# EasyEDA Pro project Trace_4层_2.8TFT码表_AT32F435RGT7_阻抗匹配.eprj

# Schematic Trace

## Sheets
1 Sheet_1 copy
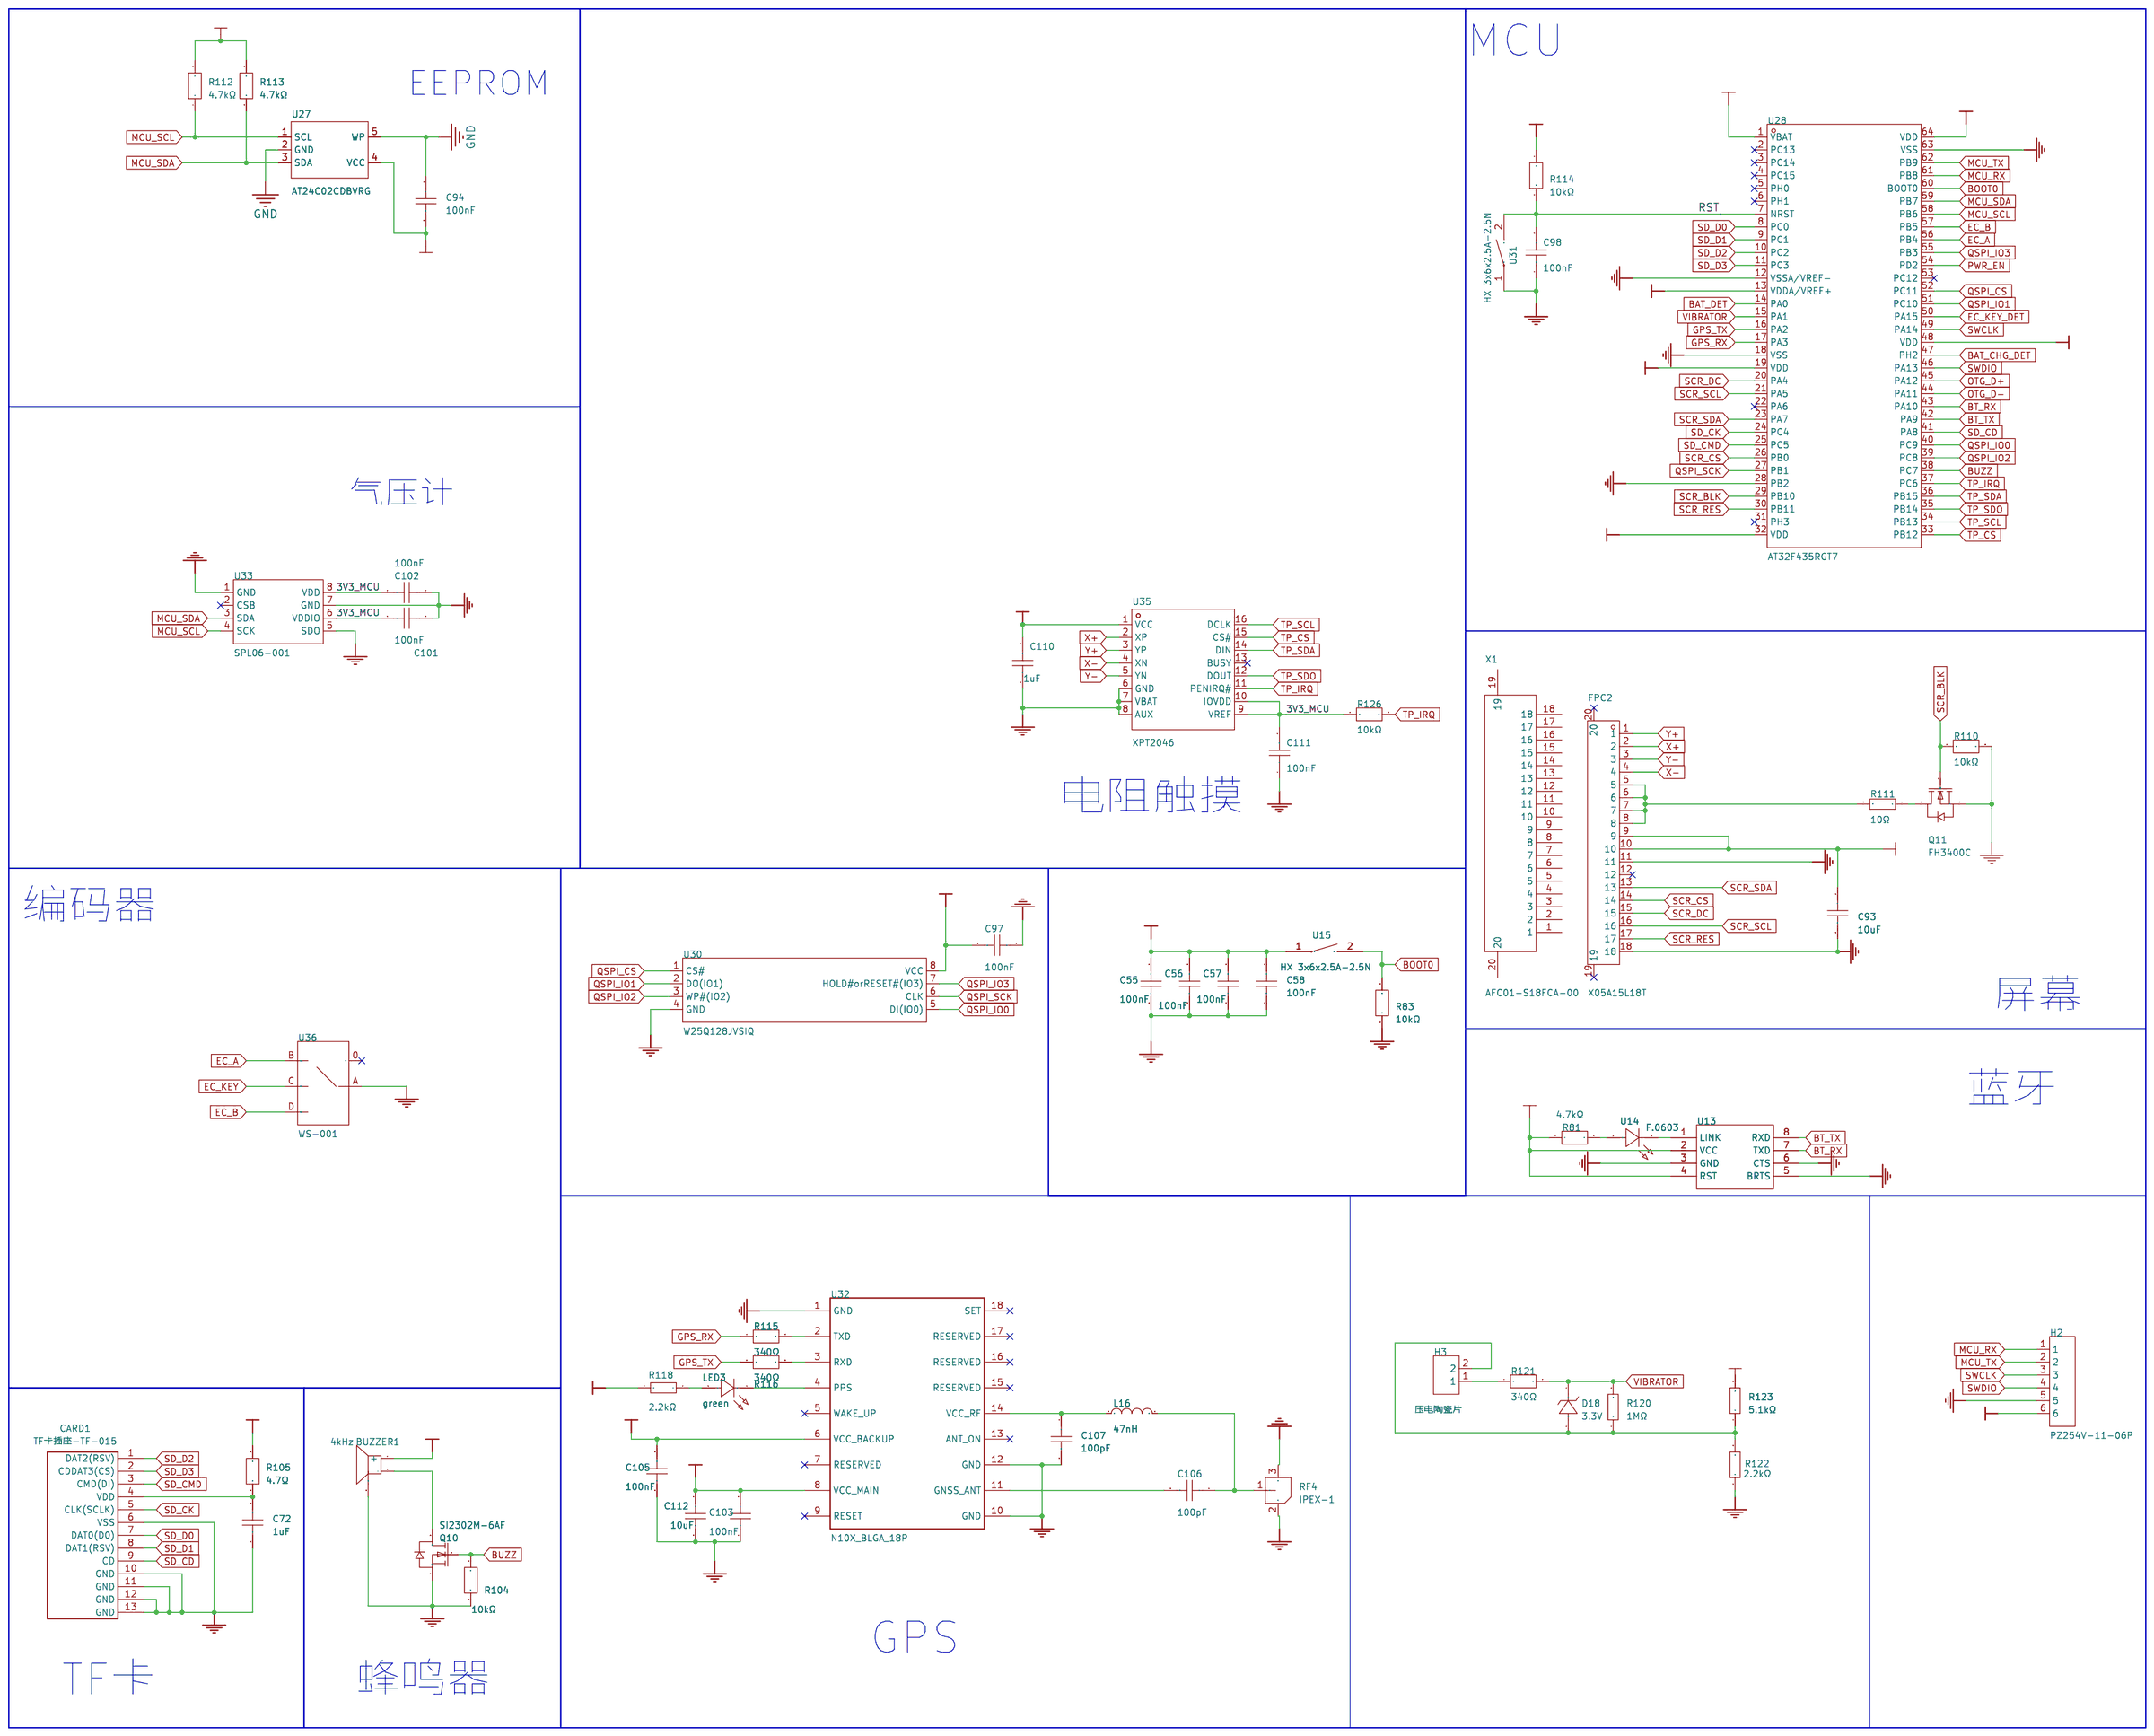
[diagram p0: Sheet_1 copy]
2 Power_Supply: Board Name: Trace; Create Date: 2025-09-24; Page Name: Power_Supply; Project Name: Trace_4层_2.8TFT码表_AT32F435RGT7_阻抗匹配; Schematic Name: Trace; Update Date: 2025-09-24; Company: 嘉立创EDA; Page Size: A4; Version: V1.0
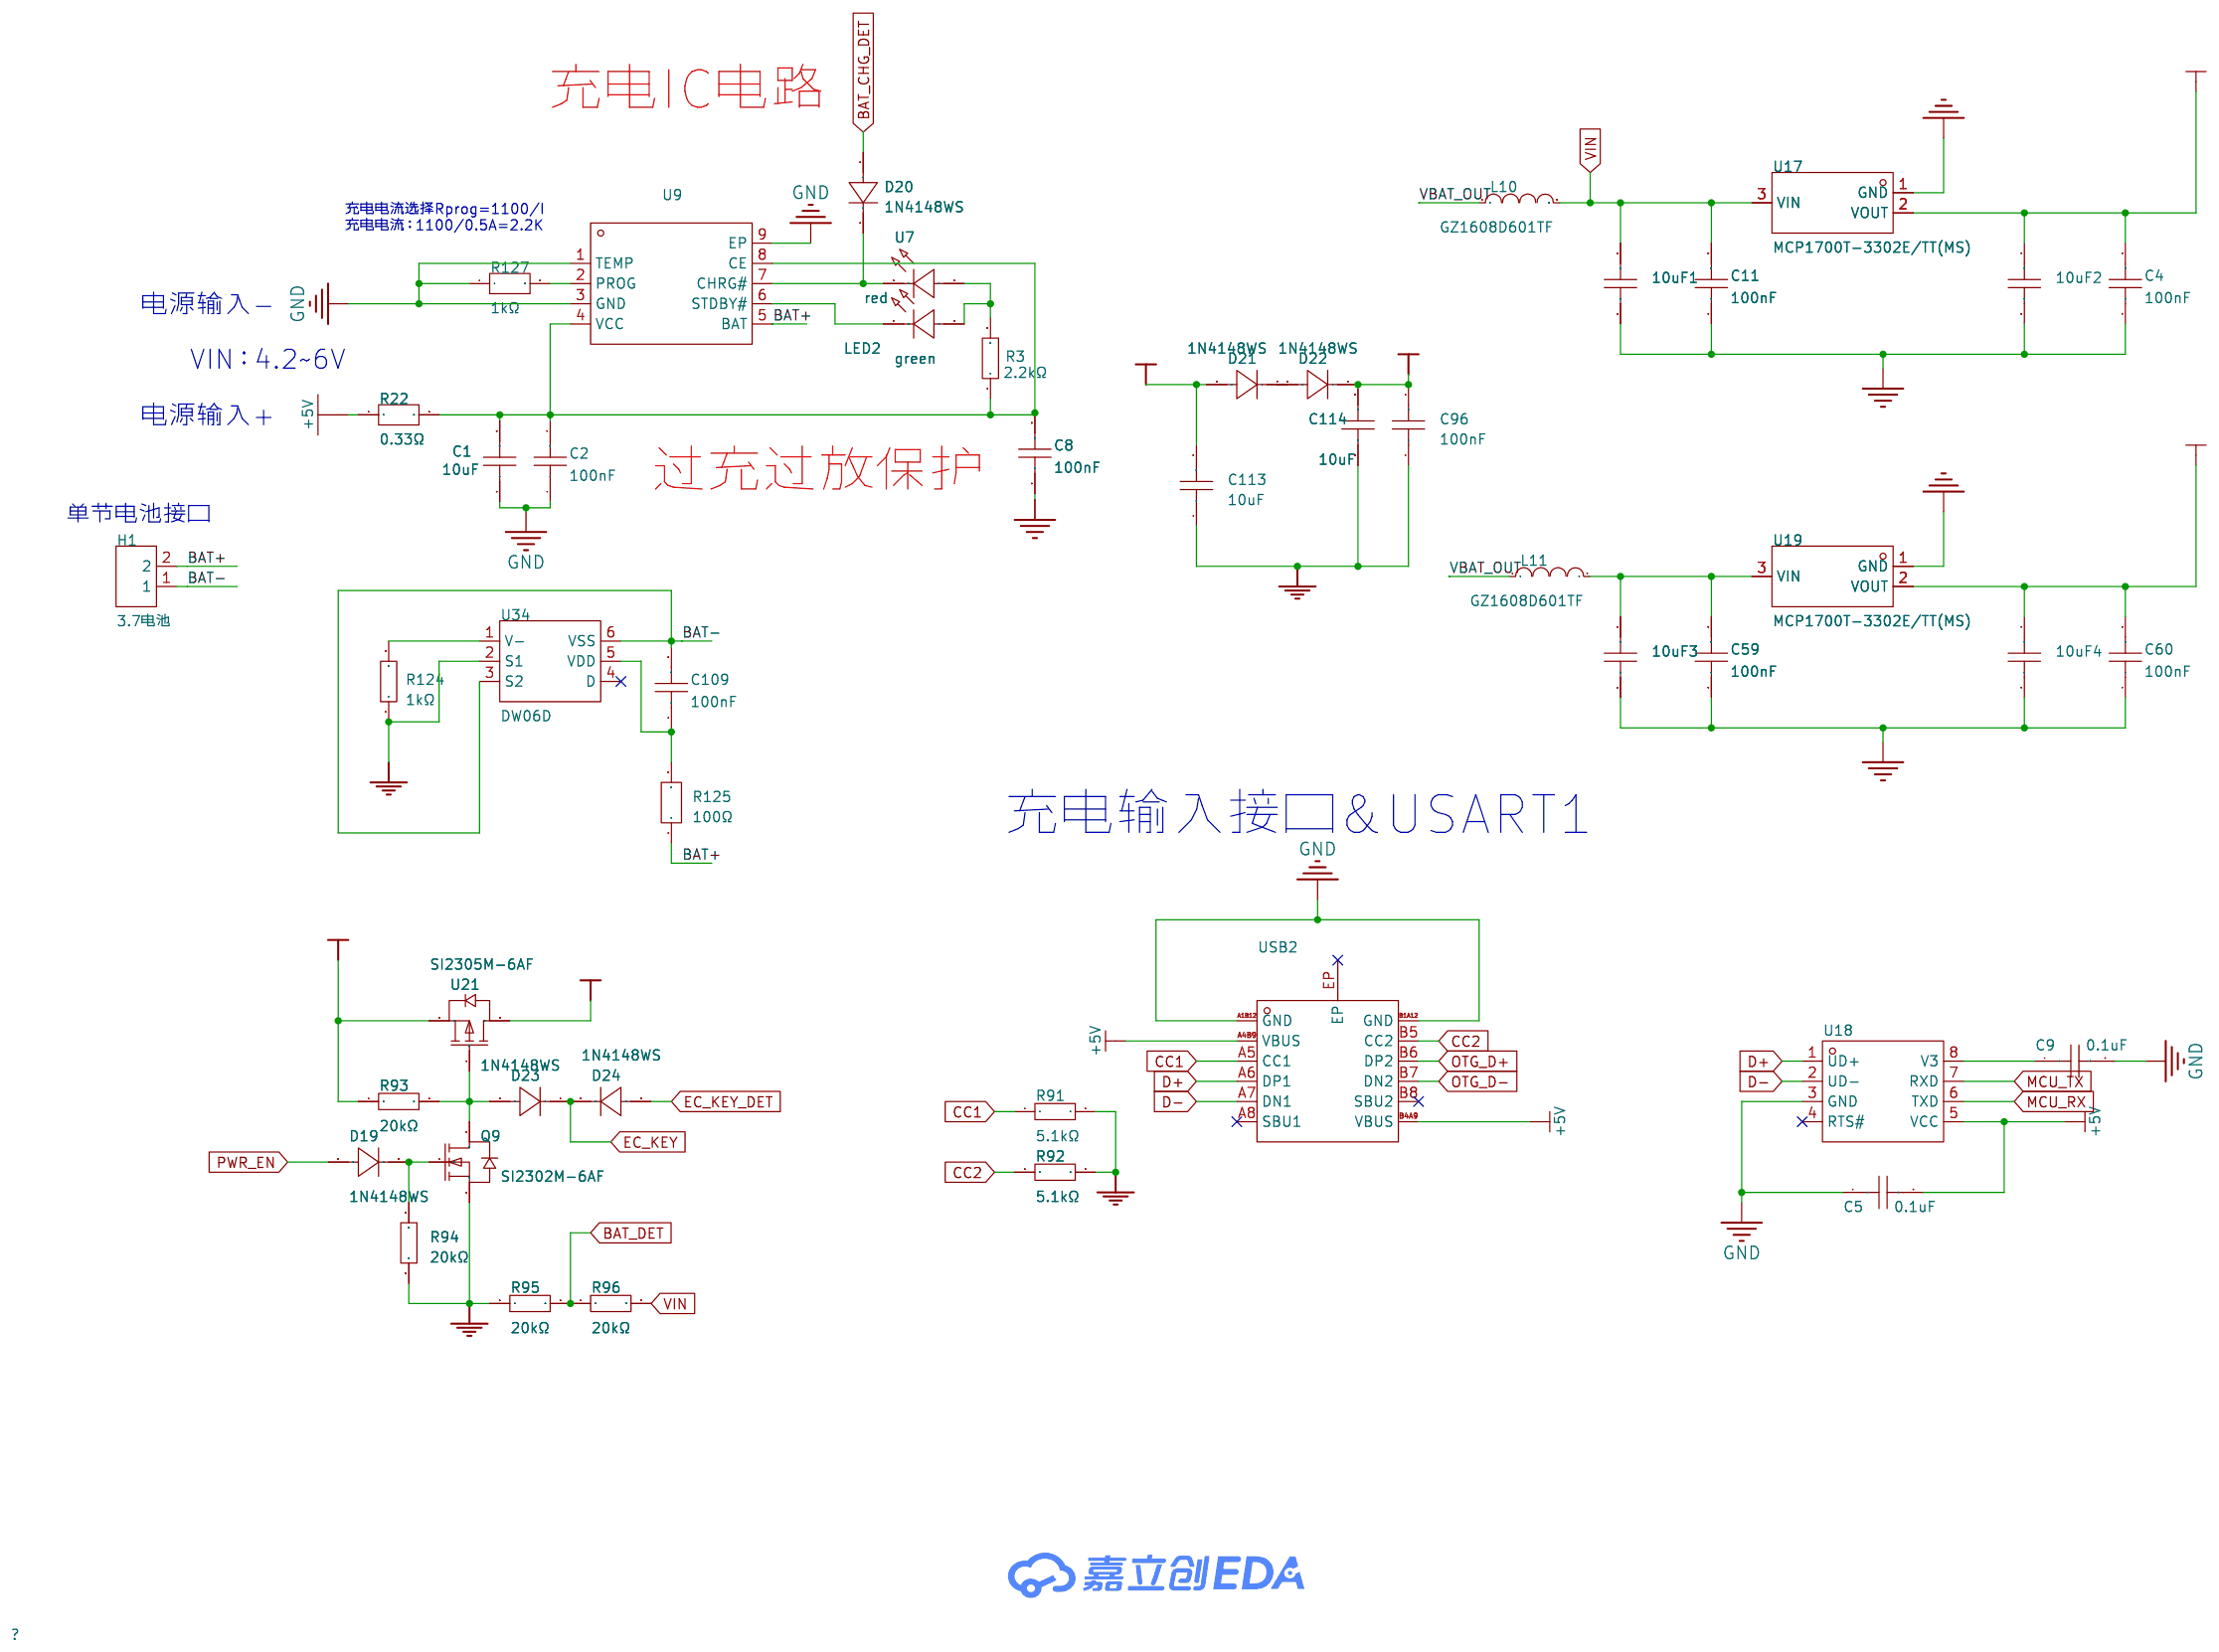
[diagram p1: Power_Supply]

## Parts
sheet Power_Supply
10uF1  10uF  [C0603]
10uF2  10uF  [C0603]
10uF3  10uF  [C0603]
10uF4  10uF  [C0603]
C1  10uF  [C0603]
C2  100nF  [C0603]
C4  100nF  [C0603]
C5  0.1uF  [C0603]
C8  100nF  [C0603]
C9  0.1uF  [C0603]
C11  100nF  [C0603]
C59  100nF  [C0603]
C60  100nF  [C0603]
C96  100nF  [C0603]
C109  100nF  [C0603]
C113  10uF  [C0603]
C114  10uF  [C0603]
D19  1N4148WS  [SOD-323_L1.8-W1.3-LS2.5-RD]
D20  1N4148WS  [SOD-323_L1.8-W1.3-LS2.5-RD]
D21  1N4148WS  [SOD-323_L1.8-W1.3-LS2.5-RD]
D22  1N4148WS  [SOD-323_L1.8-W1.3-LS2.5-RD]
D23  1N4148WS  [SOD-323_L1.8-W1.3-LS2.5-RD]
D24  1N4148WS  [SOD-323_L1.8-W1.3-LS2.5-RD]
H1  3.7电池  [HDR-TH_2P-P2.54-V-M]
L10  GZ1608D601TF  [L0603]
L11  GZ1608D601TF  [L0603]
LED2  green  [LED0603-RD_GREEN]
Q9  SI2302M-6AF  [SOT-23-3_L2.9-W1.3-P1.90-LS2.4-BR]
R3  2.2kΩ  [R0603]
R22  0.33Ω  [R1206]
R91  5.1kΩ  [R0603]
R92  5.1kΩ  [R0603]
R93  20kΩ  [R0603]
R94  20kΩ  [R0603]
R95  20kΩ  [R0603]
R96  20kΩ  [R0603]
R124  1kΩ  [R0603]
R125  100Ω  [R0603]
R127  1kΩ  [R0603]
U7  red  [LED0603-RD]
U9  -  [ESOP-8_L4.9-W3.9-P1.27-LS6.0-BL-EP]
U17  MCP1700T-3302E/TT(MS)  [SOT-23-3_L2.9-W1.3-P1.90-LS2.4-BR]
U18  -  [SOP-8_L4.9-W3.9-P1.27-LS6.0-BL]
U19  MCP1700T-3302E/TT(MS)  [SOT-23-3_L2.9-W1.3-P1.90-LS2.4-BR]
U21  SI2305M-6AF  [SOT-23-3_L2.9-W1.3-P1.90-LS2.4-BR]
U34  DW06D  [SOT-23-6_L2.9-W1.6-P0.95-LS2.8-BR]
USB2  -  [USB-C-SMD_TYPE-C-16P-1]
sheet Sheet_1 copy
BUZZER1  4kHz  [BUZ-SMD_3P-SMD5020-ZK]
C55  100nF  [C0603]
C56  100nF  [C0603]
C57  100nF  [C0603]
C58  100nF  [C0603]
C72  1uF  [C0603]
C93  10uF  [C0603]
C94  100nF  [C0603]
C97  100nF  [C0603]
C98  100nF  [C0603]
C101  100nF  [C0603]
C102  100nF  [C0603]
C103  100nF  [C0603]
C105  100nF  [C0603]
C106  100pF  [C0603]
C107  100pF  [C0603]
C110  1uF  [C0603]
C111  100nF  [C0603]
C112  10uF  [C0603]
CARD1  TF卡插座-TF-015  [TF卡插座-TF-015]
D18  3.3V  [SOD-323_L1.7-W1.3-LS2.6-RD]
FPC2  X05A15L18T  [FFC-SMD_18P-P0.50_X05A15L18T]
H2  PZ254V-11-06P  [HDR-TH_6P-P2.54-V-M]
H3  压电陶瓷片  [HDR-TH_2P-P2.54-V-M]
L16  47nH  [IND-SMD_L1.8-W1.0]
LED3  green  [LED0603-RD_GREEN]
Q10  SI2302M-6AF  [SOT-23-3_L2.9-W1.3-P1.90-LS2.4-BR]
Q11  FH3400C  [SOT-23-3_L2.9-W1.3-P1.90-LS2.4-BR]
R81  4.7kΩ  [R0603]
R83  10kΩ  [R0603]
R104  10kΩ  [R0603]
R105  4.7Ω  [R0603]
R110  10kΩ  [R0603]
R111  10Ω  [R0603]
R112  4.7kΩ  [R0603]
R113  4.7kΩ  [R0603]
R114  10kΩ  [R0603]
R115  340Ω  [R0603]
R116  340Ω  [R0603]
R118  2.2kΩ  [R0603]
R120  1MΩ  [R0603]
R121  340Ω  [R0603]
R122  2.2kΩ  [R0603]
R123  5.1kΩ  [R0603]
R126  10kΩ  [R0603]
RF4  IPEX-1  [IPEX-SMD_3P-L2.6-W2.6-LS3.0_RF1200001R]
U13  -  [XY-MBO35A]
U14  F.0603  [LED0603-RD]
U15  HX 3x6x2.5A-2.5N  [SW-SMD_HX-TS-1101-C-W]
U27  AT24C02CDBVRG  [SOT-23-5_L2.9-W1.6-P0.95-LS2.8-BR]
U28  AT32F435RGT7  [LQFP-64_L10.0-W10.0-P0.50-LS12.0-BL]
U30  W25Q128JVSIQ  [SOIC-8_L5.3-W5.3-P1.27-LS8.0-BL]
U31  HX 3x6x2.5A-2.5N  [SW-SMD_HX-TS-1101-C-W]
U32  N10X_BLGA_18P  [N10_BLGA_18P]
U33  SPL06-001  [SENSOR-SMD_SPL06-001]
U35  XPT2046  [TSSOP-16_L5.0-W4.4-P0.65-LS6.4-BL]
U36  WS-001  [SW-SMD_WS-001]
X1  AFC01-S18FCA-00  [FPC-SMD_18P-P0.50_JS_AFC01-S18FCA-00]

## Library data of the parts
10uF1-10uF4 = CAP_0603: Supplier Footprint: 0603
C1 = CL10A106KP8NNNC: 容值:10uF;精度:±10%;额定电压:10V;材质(温度系数):X5R;; LCSC Part Name: 10uF ±10% 10V; Supplier Part: C19702; Manufacturer: SAMSUNG(三星); Supplier Footprint: 0603; JLCPCB Part Class: 基础库; Datasheet: https://atta.szlcsc.com/upload/public/pdf/source/20160218/1457707763339.pdf; Supplier: LCSC; Tolerance: ±10%; Voltage Rated: 10V; Temperature Coefficient: X5R
C2 C4 C8 C11 C55-C60 C94 C96-C98 C101-C103 C105 C109 C111 = CC0603KRX7R9BB104: 容值:100nF;精度:±10%;额定电压:50V;温度系数:X7R;; LCSC Part Name: 100nF ±10% 50V; Supplier Part: C14663; Manufacturer: YAGEO(国巨); Supplier Footprint: 0603; JLCPCB Part Class: 基础库; Datasheet: https://atta.szlcsc.com/upload/public/pdf/source/20250214/096C4C206003071F5D32E5F0D8E7F8DF.pdf; Supplier: LCSC; Tolerance: ±10%; Voltage Rating: 50V; Temperature Coefficient: X7R
C5 C9 = CAP_0603: 容值:100nF;精度:±10%;额定电压:50V;温度系数:X7R;; Supplier Footprint: 0603
C112-C114 = CL10A106MA8NRNC: LCSC Part Name: 10uF ±20% 25V; Supplier Part: C96446; Manufacturer: SAMSUNG(三星); Supplier Footprint: 0603; JLCPCB Part Class: 基础库; Datasheet: https://item.szlcsc.com/datasheet/CL10A106MA8NRNC/97651.html; Supplier: LCSC; Tolerance: ±20%; Voltage Rating: 25V; Temperature Coefficient: X5R
D19-D24 = 1N4148WS: LCSC Part Name: 电压:100V 电流:150mA; Supplier Part: C909968; Manufacturer: GOODWORK(固得沃克); Supplier Footprint: SOD-323; JLCPCB Part Class: 扩展库; Datasheet: https://item.szlcsc.com/datasheet/1N4148WS/977348.html; Supplier: LCSC; Diode Configuration: 独立式; Voltage - Forward(Vf@If): 1.25V@150mA; Voltage - DC Reverse(Vr): 100V; Current - Rectified: 150mA; Pd - Power Dissipation: 250mW; Reverse Leakage Current (Ir): 1uA@100V; Reverse Recovery Time (trr): 4ns; Operating Junction Temperature Range: -55℃~+150℃@(Tj)
H1 H3 = PZ254V-11-02P: 插针结构:1x2P;间距:2.54mm;行距:-;圆针/方针:方针;安装方式:直插;排数:单排;总PIN位数:2P;额定电流:-;额定电压:-;配合针长度:6mm;塑高:2.5mm;端接针长度:3mm;触头材质:黄铜;触头镀层:-;工作温度:-40℃~+105℃;颜色:黑色;; LCSC Part Name: 1x2P 间距:2.54mm 方针 直插; Supplier Part: C492401; Manufacturer: XFCN(兴飞); Supplier Footprint: 插件,P=2.54mm; JLCPCB Part Class: 扩展库; Datasheet: https://atta.szlcsc.com/upload/public/pdf/source/20200309/C492401_A812433581A9B211A7FFA413ADDFF0E5.pdf; Supplier: LCSC; Pin Structure: 1x2P; Pitch: 2.54mm; Circluar Pins/Square Pins: 方针; Mounting Type: 直插; Number of Rows: 单排; Number of Pins: 2P; Length of Mating Pin: 6mm; Insulation Height: 2.5mm; Length of End Connection Pin: 3mm; Contact Material: 黄铜; Operating Temperature: -40℃~+105℃; Color: 黑色
L10 L11 = GZ1608D601TF: 阻抗 @ 频率:600Ω@100MHz;误差:±25%;直流电阻(DCR):450mΩ;; LCSC Part Name: 单路 0603磁珠 阻抗600Ω@100MHz; Supplier Part: C1002; Manufacturer: Sunlord(顺络); Supplier Footprint: 0603; JLCPCB Part Class: 基础库; Datasheet: https://atta.szlcsc.com/upload/public/pdf/source/20241120/893429B990C3BA07384E734821D2F218.pdf; Supplier: LCSC; Impedance @ Frequency: 600Ω@100MHz; Tolerance: ±25%; DC Resistance: 450mΩ; Current Rating: 200mA; Circuits: 1
LED2 LED3 = F.0603.00025/P2-0603G1TS2-06T-002: 发光颜色:翠绿色;正向压降(Vf):2.6V~2.9V;正向电流:-;波长:520nm~525nm;透镜颜色:-;发光强度:230mcd;发光角度:120°;工作温度:-40℃~+85℃;; Supplier Part: C7496818; Manufacturer: TUOZHAN(拓展光电); Supplier Footprint: 0603; JLCPCB Part Class: 扩展库; Datasheet: https://atta.szlcsc.com/upload/public/pdf/source/20230809/EA2F9723ADA317BF34481AEADE85B597.pdf; Supplier: LCSC; Illumination Color: 翠绿色; Voltage - Forward(Vf): 2.6V~2.9V; Wavelength - Dominant: 520nm~525nm; Luminous Intensity: 230mcd; Viewing Angle: 120°; Operating Temperature: -40℃~+85℃
Q9 Q10 = SI2302M-6AF: 数量:1个N沟道;漏源电压(Vdss):20V;连续漏极电流(Id):4.3A;导通电阻(RDS(on)):22mΩ@4.5V;耗散功率(Pd):1.2W;阈值电压(Vgs(th)):700mV;; LCSC Part Name: N沟道 SI2302M-6AF SOT-23; Supplier Part: C48587199; Manufacturer: FOSAN(富捷/富信); Supplier Footprint: SOT-23; JLCPCB Part Class: 扩展库; Datasheet: https://atta.szlcsc.com/upload/public/pdf/source/20250427/46BDFA2DA746C72205CEC26501824533.pdf; Supplier: LCSC; Number: 1个N沟道; Drain to Source Voltage: 20V; Current - Continuous Drain(Id): 4.3A; RDS(on): 22mΩ@4.5V; Pd - Power Dissipation: 1.2W; Gate Threshold Voltage (Vgs(th)@Id): 700mV; Input Capacitance(Ciss): 260pF; Type: N沟道
R3 R118 R122 = 0603WAF2201T5E: 电阻类型:厚膜电阻;阻值:2.2kΩ;精度:±1%;功率:100mW;最大工作电压:75V;温度系数:±100ppm/℃;; LCSC Part Name: 2.2kΩ ±1% 100mW 厚膜电阻; Supplier Part: C4190; Manufacturer: UNI-ROYAL(厚声); Supplier Footprint: 0603; JLCPCB Part Class: 基础库; Datasheet: https://atta.szlcsc.com/upload/public/pdf/source/20200306/C422600_1E6D84923E4A46A82E41ADD87F860B5C.pdf; Supplier: LCSC; Type: 厚膜电阻; Tolerance: ±1%; Power(Watts): 100mW; Overload Voltage (Max): 75V; Temperature Coefficient: ±100ppm/℃; Operating Temperature Range: -55℃~+155℃
R22 = FRC1206F1R00TS: 电阻类型:厚膜电阻;阻值:1Ω;精度:±1%;功率:250mW;工作电压:200V;温度系数:±200ppm/℃;; LCSC Part Name: 1Ω ±1% 250mW 厚膜电阻; Supplier Part: C2907374; Manufacturer: Milliohm(毫欧); Supplier Footprint: 1206; JLCPCB Part Class: 扩展库; Datasheet: https://atta.szlcsc.com/upload/public/pdf/source/20211221/925EC7D7225764EE0046F22065062C87.pdf; Supplier: LCSC; Type: 厚膜电阻; Tolerance: ±1%; Power(Watts): 250mW; Voltage-Supply(Max): 200V; Temperature Coefficient: ±200ppm/℃; Operating Temperature: -55℃~+155℃
R91 R92 R123 = 0603WAF5101T5E: 电阻类型:厚膜电阻;阻值:5.1kΩ;精度:±1%;功率:100mW;工作电压:75V;温度系数:±100ppm/℃;; LCSC Part Name: 5.1kΩ ±1% 100mW 厚膜电阻; Supplier Part: C23186; Manufacturer: UNI-ROYAL(厚声); Supplier Footprint: 0603; JLCPCB Part Class: 基础库; Datasheet: https://atta.szlcsc.com/upload/public/pdf/source/20200306/C422600_1E6D84923E4A46A82E41ADD87F860B5C.pdf; Supplier: LCSC; Type: 厚膜电阻; Tolerance: ±1%; Power(Watts): 100mW; Voltage-Supply(Max): 75V; Temperature Coefficient: ±100ppm/℃; Operating Temperature: -55℃~+155℃
R93-R96 = 0603WAF2002T5E: 电阻类型:厚膜电阻;阻值:20kΩ;精度:±1%;功率:100mW;工作电压:75V;温度系数:±100ppm/℃;; LCSC Part Name: 20kΩ ±1% 100mW 厚膜电阻; Supplier Part: C4184; Manufacturer: UNI-ROYAL(厚声); Supplier Footprint: 0603; JLCPCB Part Class: 基础库; Datasheet: https://atta.szlcsc.com/upload/public/pdf/source/20200306/C422600_1E6D84923E4A46A82E41ADD87F860B5C.pdf; Supplier: LCSC; Type: 厚膜电阻; Tolerance: ±1%; Power(Watts): 100mW; Voltage-Supply(Max): 75V; Temperature Coefficient: ±100ppm/℃; Operating Temperature: -55℃~+155℃
R124 = 0603WAF1001T5E: 电阻类型:厚膜电阻;阻值:1kΩ;精度:±1%;功率:100mW;最大工作电压:75V;温度系数:±100ppm/℃;; LCSC Part Name: 1kΩ ±1% 100mW 厚膜电阻; Supplier Part: C21190; Manufacturer: UNI-ROYAL(厚声); Supplier Footprint: 0603; JLCPCB Part Class: 基础库; Datasheet: https://atta.szlcsc.com/upload/public/pdf/source/20200306/C422600_1E6D84923E4A46A82E41ADD87F860B5C.pdf; Supplier: LCSC; Type: 厚膜电阻; Tolerance: ±1%; Power(Watts): 100mW; Overload Voltage (Max): 75V; Temperature Coefficient: ±100ppm/℃; Operating Temperature Range: -55℃~+155℃
R125 = HoAR0603-1/10W-100R-0.1%-TCR25: 电阻类型:陶瓷电阻;阻值:100Ω;精度:±0.1%;功率:100mW;温度系数:±25ppm/℃;; LCSC Part Name: 陶瓷电阻 100Ω ±0.1% 100mW; Supplier Part: C5123580; Manufacturer: Milliohm(毫欧); Supplier Footprint: 0603; JLCPCB Part Class: 扩展库; Datasheet: https://atta.szlcsc.com/upload/public/pdf/source/20220805/5B29E47E7B89BC0967125BB581C83C8E.pdf; Supplier: LCSC; Type: 陶瓷电阻; Tolerance: ±0.1%; Power(Watts): 100mW; Temperature Coefficient: ±25ppm/℃
R127 = FRC0603F1001TS: LCSC Part Name: 1kΩ ±1% 100mW 厚膜电阻; Supplier Part: C2907002; Manufacturer: FOJAN(富捷); Supplier Footprint: 0603; JLCPCB Part Class: 扩展库; Supplier: LCSC; Type: 厚膜电阻; Tolerance: ±1%; Power(Watts): 100mW; Voltage-Supply(Max): 75V; Temperature Coefficient: ±100ppm/℃; Operating Temperature: -55℃~+155℃
U7 = F.0603.00139/P2-0603R1TS2-06T-002: 发光颜色:红色;正向电流:-;透镜颜色:-;发光角度:120°;工作温度:-40℃~+85℃;; Supplier Part: C7496820; Manufacturer: TUOZHAN(拓展光电); Supplier Footprint: 0603; JLCPCB Part Class: 扩展库; Datasheet: https://atta.szlcsc.com/upload/public/pdf/source/20230809/2283CFC12D1EC1C972D0489FE4CEE0B0.pdf; Supplier: LCSC; Illumination Color: 红色; Viewing Angle: 120°; Operating Temperature: -40℃~+85℃
U9 = TP4056_1: 充电电池的类型:-;电池单元组数:-;最大充电电流:-;充满的电池组电压:-;最大供应电压:-;; LCSC Part Name: 1A鋰電池充電IC; Supplier Part: C382139; Manufacturer: TPOWER(天源); Manufacturer Part: TP4056; Supplier Footprint: ESOP-8; JLCPCB Part Class: Extended Part; Datasheet: https://atta.szlcsc.com/upload/public/pdf/source/20190327/C382139_EC85960E6FE3E26856C240C81751A184.pdf; Supplier: LCSC
U17 U19 = MCP1700T-3302E/TT(MS): 输出类型:固定;最大输入电压:5.5V;输出电压:3.3V;输出电流:300mA;电源纹波抑制比(PSRR):-;输出极性:正极;; Supplier Part: C20627188; Manufacturer: MSKSEMI(美森科); Supplier Footprint: SOT-23; JLCPCB Part Class: 扩展库; Datasheet: https://atta.szlcsc.com/upload/public/pdf/source/20240318/6FC6A66C6DA118FF36525C322FF1B1EC.pdf; Supplier: LCSC; Output Type: 固定; Maximum Input Voltage: 5.5V; Output Voltage: 3.3V; Output Current: 300mA; Feature: 自动放电功能；低ESR；热保护(TSD)；过流保护(OCP)；带使能; Operating Temperature: -40℃~+125℃@(Tj); Output Polarity: 正极; Number of Outputs: 1
U18 = CH340N: Supplier Part: C2977777; Manufacturer: WCH(南京沁恒); Supplier Footprint: SOP-8; JLCPCB Part Class: 扩展库; Datasheet: https://atta.szlcsc.com/upload/public/pdf/source/20220223/82A45E4FF89B3EDCAD50B354450A7EF4.pdf; Supplier: LCSC
U21 = SI2305M-6AF: 数量:1个P沟道;漏源电压(Vdss):20V;连续漏极电流(Id):5.5A;导通电阻(RDS(on)):29mΩ@4.5V;耗散功率(Pd):1.2W;阈值电压(Vgs(th)):620mV;; LCSC Part Name: P沟道 SI2305M-6AF SOT-23; Supplier Part: C48587196; Manufacturer: FOSAN(富捷/富信); Supplier Footprint: SOT-23; JLCPCB Part Class: 扩展库; Datasheet: https://atta.szlcsc.com/upload/public/pdf/source/20250427/BB41724E7B2D510A75925682BCAE72D1.pdf; Supplier: LCSC; Number: 1个P沟道; Drain to Source Voltage: 20V; Current - Continuous Drain(Id): 5.5A; RDS(on): 29mΩ@4.5V; Pd - Power Dissipation: 1.2W; Gate Threshold Voltage (Vgs(th)@Id): 620mV; Input Capacitance(Ciss): 1.01nF; Operating Temperature: -50℃~+150℃; Configuration: 沟槽; Type: P沟道
U34 = DW06D: 工作电压:1.5V~10V;最大充电电流:-;电池类型:锂离子/聚合物;电池节数:1;; LCSC Part Name: 二合一锂电池保护IC; Supplier Part: C22399520; Manufacturer: GOODWORK(固得沃克); Supplier Footprint: SOT-23-6; JLCPCB Part Class: 扩展库; Datasheet: https://item.szlcsc.com/datasheet/DW06D/24016241.html; Supplier: LCSC; The Chip Type: 电池保护芯片; Voltage - Supply: 1.5V~10V; Charging Saturation Voltage: 4.3V; End-Off Voltage: 2.4V; Type of Battery: 锂离子/聚合物; Number of Cells: 1; Operating Temperature: -40℃~+85℃
USB2 = TYPEC-304-ACP16: 连接器类型:Type-C;标准:-;公母:母座;触点数量:16Pin;端口数量:1;安装方式:卧贴;额定电流 - 电源:3A;触头材质:铜;触头镀层:镀金;工作温度范围:-40~+85;焊接温度(最大值):-;; LCSC Part Name: Type-C母座卧贴; Supplier Part: C2982555; Manufacturer: XUNPU(讯普); Supplier Footprint: SMD; JLCPCB Part Class: 扩展库; Datasheet: https://atta.szlcsc.com/upload/public/pdf/source/20220311/3C907F75E12F45E4EE7F73565AB9C294.pdf; Supplier: LCSC; Connector Type: Type-C; Gender: 母座; Number of Contacts: 16Pin; Number of Ports: 1; Mounting Style: 卧贴; Current Rating - Power (Max): 3A; Contact Material: 铜; Contact Plating: 镀金; Operating Temperature Range: -40~+85
BUZZER1 = SMD5020-ZK: LCSC Part Name: 蜂鸣器; Supplier Part: C49246955; Manufacturer: XHXDZ(兴华鑫); Supplier Footprint: SMD,5.3x5.3mm; JLCPCB Part Class: 扩展库; Datasheet: https://item.szlcsc.com/datasheet/SMD5020-ZK/51674924.html; Supplier: LCSC; Driver Circuitry: 无源(外部驱动); Technology: 电磁式; Voltage Rating: 3V; Voltage - Supply: 2V~4V; Current Consumption: 100mA; Sound Pressure Level(SPL): 78dB; Length: 5mm; Width: 5mm; Height: 2mm
C72 = CGA0603X5R105K160JT: 容值:1uF;精度:±10%;额定电压:16V;温度系数:X5R;; LCSC Part Name: 1uF ±10% 16V; Supplier Part: C6119849; Manufacturer: HRE(芯声); Supplier Footprint: 0603; JLCPCB Part Class: 扩展库; Supplier: LCSC; Tolerance: ±10%; Voltage Rating: 16V; Temperature Coefficient: X5R
C93 = CGA0603X5R106K100JT: 容值:10uF;精度:±10%;额定电压:10V;温度系数:X5R;; LCSC Part Name: 10uF ±10% 10V; Supplier Part: C6119842; Manufacturer: HRE(芯声); Supplier Footprint: 0603; JLCPCB Part Class: 扩展库; Supplier: LCSC; Tolerance: ±10%; Voltage Rating: 10V; Temperature Coefficient: X5R
C106 C107 = CGA0603C0G101J500JT: 容值:100pF;精度:±5%;额定电压:50V;温度系数:C0G;; LCSC Part Name: 100pF ±5% 50V; Supplier Part: C45359929; Manufacturer: HRE(芯声); Supplier Footprint: 0603; Datasheet: https://atta.szlcsc.com/upload/public/pdf/source/20250220/F7F63959251C0C87BFE6C7B508A8A35C.pdf; Supplier: LCSC; Tolerance: ±5%; Voltage Rating: 50V; Temperature Coefficient: C0G
C110 = CL10A105KB8NNNC: 容值:1uF;精度:±10%;额定电压:50V;温度系数:X5R;; LCSC Part Name: 1uF ±10% 50V; Supplier Part: C15849; Manufacturer: SAMSUNG(三星); Supplier Footprint: 0603; JLCPCB Part Class: 基础库; Datasheet: https://item.szlcsc.com/datasheet/CL10A105KB8NNNC/16531.html; Supplier: LCSC; Tolerance: ±10%; Voltage Rating: 50V; Temperature Coefficient: X5R
CARD1 = TF卡插座-TF-015: Supplier: LCSC; Manufacturer: SOFNG; Manufacturer Part: TF-015; Supplier Part: C113206; Contributor: DoM; spicePre: C
D18 = BZT52C3V3S_C19077437: 二极管配置:独立式;稳压值(标称值):3.3V;稳压值(范围):3.1V~3.5V;耗散功率(Pd):200mW;; LCSC Part Name: 独立式 耐压:3.3V 电流:5uA@1.0V; Supplier Part: C19077437; Manufacturer: 宏嘉诚; Supplier Footprint: SOD-323; JLCPCB Part Class: 扩展库; Datasheet: https://item.szlcsc.com/datasheet/BZT52C3V3S/20275522.html; Supplier: LCSC; Diode Configuration: 独立式; Reverse Leakage Current (Ir): 5uA@1.0V; Zener Voltage(Range): 3.1V~3.5V; Pd - Power Dissipation: 200mW; Impedance(Zzt): 95Ω; Impedance(Zzk): 600Ω; Operating Junction Temperature Range: -55℃~+150℃
FPC2 = X05A15L18T: 锁定特性:翻盖式;触点类型:下接;触点数量:18P;间距:0.5mm;安装类型:卧贴;工作温度范围:-25℃~+85℃;焊接温度(最大值):260℃;; LCSC Part Name: 间距:0.5mm P数:18P 翻盖式 下接; Supplier Part: C437037; Manufacturer: XKB Connectivity(中国星坤); Supplier Footprint: SMD,P=0.5mm,卧贴; JLCPCB Part Class: 扩展库; Datasheet: https://atta.szlcsc.com/upload/public/pdf/source/20211011/36129A217307A997C83CD7A5761508E1.pdf; Supplier: LCSC; Locking Feature: 翻盖式; Contact Type: 下接; Number of Contacts: 18P; Pitch: 0.5mm; Mounting Type: 卧贴; FFC, FCB Thickness: 0.3mm; Height Above Board: 1.5mm; Contact Material: 铜合金; Contact Plating: 锡; Operating Temperature Range: -25℃~+85℃; Soldering Temperature(Max): 260℃
H2 = PZ254V-11-06P: 插针结构:1x6P;间距:2.54mm;行距:-;圆针/方针:方针;安装方式:直插;排数:单排;总PIN位数:6P;额定电流:-;额定电压:-;配合针长度:6mm;塑高:2.5mm;端接针长度:3mm;触头材质:黄铜;触头镀层:-;工作温度:-40℃~+105℃;颜色:黑色;; LCSC Part Name: 1x6P 间距:2.54mm 方针 直插; Supplier Part: C492405; Manufacturer: XFCN(兴飞); Supplier Footprint: 插件,P=2.54mm; JLCPCB Part Class: 扩展库; Datasheet: https://atta.szlcsc.com/upload/public/pdf/source/20200309/C492405_597F1930F5B55CC3C7FD95458F1C3977.pdf; Supplier: LCSC; Pin Structure: 1x6P; Pitch: 2.54mm; Circluar Pins/Square Pins: 方针; Mounting Type: 直插; Number of Rows: 单排; Number of Pins: 6P; Length of Mating Pin: 6mm; Insulation Height: 2.5mm; Length of End Connection Pin: 3mm; Contact Material: 黄铜; Operating Temperature: -40℃~+105℃; Color: 黑色
L16 = AHW1608C-47NJTF: 电感值:47nH;精度:±5%;额定电流:600mA;直流电阻(DCR):280mΩ;; LCSC Part Name: 47nH ±5%; Supplier Part: C6807998; Manufacturer: APV(爱普微); Supplier Footprint: 0603; JLCPCB Part Class: 扩展库; Datasheet: https://atta.szlcsc.com/upload/public/pdf/source/20230523/1C3BB767D502EE2DA5073F35EE6596F6.pdf; Supplier: LCSC; Tolerance: ±5%; Current Rating: 600mA; DC Resistance(DCR): 280mΩ; Q @ Frequency: 38; Frequency - Self Resonant: 2GHz; Type: 绕线片式电感
Q11 = FH3400C: Supplier: LCSC; Supplier Part: C2940037; Manufacturer: 鑫飞宏; JLCPCB Part Class: Extended Part
R81 R112 R113 = FRC0603J472 TS: 电阻类型:厚膜电阻;阻值:4.7kΩ;精度:±5%;功率:100mW;最大工作电压:75V;温度系数:±100ppm/℃;; LCSC Part Name: 4.7kΩ ±5% 100mW 厚膜电阻; Supplier Part: C2907166; Manufacturer: FOJAN(富捷); Supplier Footprint: 0603; JLCPCB Part Class: 扩展库; Datasheet: https://atta.szlcsc.com/upload/public/pdf/source/20211221/925EC7D7225764EE0046F22065062C87.pdf; Supplier: LCSC; Type: 厚膜电阻; Tolerance: ±5%; Power(Watts): 100mW; Overload Voltage (Max): 75V; Temperature Coefficient: ±100ppm/℃; Operating Temperature Range: -55℃~+155℃
R83 R104 R110 R114 R126 = FRC0603J103 TS: 电阻类型:厚膜电阻;阻值:10kΩ;精度:±5%;功率:100mW;工作电压:75V;温度系数:±100ppm/℃;; LCSC Part Name: 10kΩ ±5% 100mW 厚膜电阻; Supplier Part: C2930027; Manufacturer: FOJAN(富捷); Supplier Footprint: 0603; JLCPCB Part Class: 扩展库; Datasheet: https://atta.szlcsc.com/upload/public/pdf/source/20211221/925EC7D7225764EE0046F22065062C87.pdf; Supplier: LCSC; Type: 厚膜电阻; Tolerance: ±5%; Power(Watts): 100mW; Voltage-Supply(Max): 75V; Temperature Coefficient: ±100ppm/℃; Operating Temperature: -55℃~+155℃
R105 = FRC0603J4R7 TS: 电阻类型:厚膜电阻;阻值:4.7Ω;精度:±5%;功率:100mW;工作电压:75V;温度系数:±200ppm/℃;; LCSC Part Name: 4.7Ω ±5% 100mW 厚膜电阻; Supplier Part: C2907168; Manufacturer: FOJAN(富捷); Supplier Footprint: 0603; JLCPCB Part Class: 扩展库; Datasheet: https://atta.szlcsc.com/upload/public/pdf/source/20211221/925EC7D7225764EE0046F22065062C87.pdf; Supplier: LCSC; Type: 厚膜电阻; Tolerance: ±5%; Power(Watts): 100mW; Voltage-Supply(Max): 75V; Temperature Coefficient: ±200ppm/℃; Operating Temperature: -55℃~+155℃
R111 = 0603WAF100JT5E: 电阻类型:厚膜电阻;阻值:10Ω;精度:±1%;功率:100mW;最大工作电压:75V;温度系数:±400ppm/℃;; LCSC Part Name: 10Ω ±1% 100mW 厚膜电阻; Supplier Part: C22859; Manufacturer: UNI-ROYAL(厚声); Supplier Footprint: 0603; JLCPCB Part Class: 基础库; Datasheet: https://atta.szlcsc.com/upload/public/pdf/source/20200306/C422600_1E6D84923E4A46A82E41ADD87F860B5C.pdf; Supplier: LCSC; Type: 厚膜电阻; Tolerance: ±1%; Power(Watts): 100mW; Overload Voltage (Max): 75V; Temperature Coefficient: ±400ppm/℃; Operating Temperature Range: -55℃~+155℃
R115 R116 R121 = FRC0603J331 TS: 电阻类型:厚膜电阻;阻值:330Ω;精度:±5%;功率:100mW;最大工作电压:75V;温度系数:±100ppm/℃;; LCSC Part Name: 330Ω ±5% 100mW 厚膜电阻; Supplier Part: C2907152; Manufacturer: FOJAN(富捷); Supplier Footprint: 0603; JLCPCB Part Class: Extended Part; Datasheet: https://atta.szlcsc.com/upload/public/pdf/source/20211221/925EC7D7225764EE0046F22065062C87.pdf; Supplier: LCSC; Type: 厚膜电阻; Tolerance: ±5%; Power(Watts): 100mW; Overload Voltage (Max): 75V; Temperature Coefficient: ±100ppm/℃; Operating Temperature Range: -55℃~+155℃
R120 = 0603WAF1004T5E: 电阻类型:厚膜电阻;阻值:1MΩ;精度:±1%;功率:100mW;最大工作电压:75V;温度系数:±100ppm/℃;; LCSC Part Name: 1MΩ ±1% 100mW 厚膜电阻; Supplier Part: C22935; Manufacturer: UNI-ROYAL(厚声); Supplier Footprint: 0603; JLCPCB Part Class: 基础库; Datasheet: https://atta.szlcsc.com/upload/public/pdf/source/20200306/C422600_1E6D84923E4A46A82E41ADD87F860B5C.pdf; Supplier: LCSC; Type: 厚膜电阻; Tolerance: ±1%; Power(Watts): 100mW; Overload Voltage (Max): 75V; Temperature Coefficient: ±100ppm/℃; Operating Temperature Range: -55℃~+155℃
RF4 = IPEX-1_C47986640: RF座 IPEX天线座1代 高1.25; Supplier Part: C47986640; Manufacturer: HanElectricity(瀚源); Supplier Footprint: SMD; JLCPCB Part Class: 扩展库; Datasheet: https://atta.szlcsc.com/upload/public/pdf/source/20250429/111A623DC0E0E327606C172804F451E2.pdf; Supplier: LCSC
U13 = XY-MBO35A
U14 = F.0603.00026/P2-0603B1TS2-06T-001: 发光颜色:蓝色;正向电流:-;透镜颜色:-;发光角度:120°;工作温度:-40℃~+85℃;; Supplier Part: C7496819; Manufacturer: TUOZHAN(拓展光电); Supplier Footprint: 0603; JLCPCB Part Class: 扩展库; Datasheet: https://atta.szlcsc.com/upload/public/pdf/source/20230809/ECF6953856A20A27FF1AE7121E51C3D2.pdf; Supplier: LCSC; Illumination Color: 蓝色; Viewing Angle: 120°; Operating Temperature: -40℃~+85℃
U15 U31 = HX 3x6x2.5A-2.5N: 按钮形状:矩形按钮;作用力:2.5N;安装方式:立贴;开关长度:6mm;开关宽度:3.6mm;开关高度:2.5mm;带支架:-;触点电流:50mA;额定电压:12V;带灯:无;机械寿命:3万次;; LCSC Part Name: 6*3.6*2.5mm 立贴 轻触开关; Supplier Part: C36498960; Manufacturer: hanxia(韩下); Supplier Footprint: SMD,3x6mm; JLCPCB Part Class: 扩展库; Datasheet: https://atta.szlcsc.com/upload/public/pdf/source/20241226/6D6A5CD682680470A40B0F4BC1B5337F.pdf; Supplier: LCSC; Actuator Style: 矩形按钮; Operating Force: 2.5N; Mounting Style: 立贴; Switch Length: 6mm; Switch Width: 3.6mm; Switch Height: 2.5mm; Contact Current: 50mA; Voltage Rating: 12V; Actuator/Cap Color: 白色; With Lamp: 无; Pin Style: 鸥翼型; Mechanical Life: 3万次; Operating Temperature: -25℃~+70℃
U27 = AT24C02CDBVRG: 接口类型:I2C;存储容量:2Kbit;时钟频率(fc):1MHz;; Supplier Part: C19723706; Manufacturer: HGC(深圳汉芯); Supplier Footprint: SOT-23-5; JLCPCB Part Class: 扩展库; Datasheet: https://atta.szlcsc.com/upload/public/pdf/source/20231229/0ED440439F5B74759E29B377365D8CC9.pdf; Supplier: LCSC; Interface: I2C; Memory Size: 2Kbit; Clock Frequency: 1MHz; Voltage - Supply: 1.7V~5.5V; Write Cycle Time(Tw): 3ms; Data Retention - TDR (Year): 200年; Write Cycle Endurance: 200万次; Operating Temperature: -40℃~+105℃
U28 = AT32F435RGT7: 基于ARM  32位的Cortex -M4微控制器+FPU，带256 K字节至4032 K字节 内部闪存、sLib、双QSPI、双OTGFS、以太网、 摄像头、18个定时器、3个ADC、24个通信接口; LCSC Part Name: 基于ARM 32位的Cortex - M4微控制器; Supplier Part: C3029577; Manufacturer: ARTERY(雅特力); Supplier Footprint: LQFP-64(10x10); JLCPCB Part Class: 扩展库; Datasheet: https://item.szlcsc.com/datasheet/AT32F435RGT7/3562856.html; Supplier: LCSC
U30 = W25Q128JVSIQ_C113767: 接口类型:SPI;存储容量:-;时钟频率(fc):133MHz;; LCSC Part Name: 支持双路/四路SPI接口的3V、128Mbit 串行闪存; Supplier Part: C113767; Manufacturer: Winbond(华邦); Supplier Footprint: SOIC-8-208mil; JLCPCB Part Class: 扩展库; Datasheet: https://item.szlcsc.com/datasheet/W25Q128JVSIQ/115003.html; Supplier: LCSC; Interface: SPI; Clock Frequency: 133MHz; Voltage - Supply: 2.7V~3.6V; Program / Erase Cycles: 100000次; Page Programming Time (Tpp): 3ms
U32 = N10X_BLGA_18P: Library Name: Schlib1
U33 = SPL06-001_C2684428: 压力范围:300hpa~1100hpa;接口类型:I2C；SPI;; LCSC Part Name: 普通气压传感器 停产; Supplier Part: C2684428; Manufacturer: Goertek(歌尔); Supplier Footprint: LGA-8(2x2.5); JLCPCB Part Class: 扩展库; Datasheet: https://atta.szlcsc.com/upload/public/pdf/source/20210120/C2684428_7EA58BBCA3793458F617124FBE4BF8F1.pdf; Supplier: LCSC; Pressure range: 300hpa~1100hpa; Voltage - Supply: 1.7V~3.6V; Standby Current: 1uA; Interface: I2C；SPI; Operating Temperature: -40℃~+85℃; Absolute Accuracy: 1hpa; Relative Accuracy: 6pa; Temperature Coefficient of Offset(TCO): 0.5pa/K
U35 = XPT2046: 接口类型:-;; Supplier Part: C19076; Manufacturer: XPT(矽普特); Supplier Footprint: TSSOP-16; JLCPCB Part Class: 扩展库; Datasheet: https://item.szlcsc.com/datasheet/XPT2046/19779.html; Supplier: LCSC
U36 = WS-001: LCSC Part Name: 3脚拨轮长柄/有定位/黑底/三向; Supplier Part: C46598193; Manufacturer: HANBO(汉博); Supplier Footprint: SMD; Datasheet: https://atta.szlcsc.com/upload/public/pdf/source/20250317/81A92D0EB8B718EFE1BBA6574FD75B94.pdf; Supplier: LCSC
X1 = AFC01-S18FCA-00: LCSC Part Name: 间距:0.5mm P数:18P 翻盖式 下接; Supplier Part: C262666; Manufacturer: JS(钜硕电子); Supplier Footprint: SMD,P=0.5mm,卧贴; JLCPCB Part Class: 扩展库; Datasheet: https://item.szlcsc.com/datasheet/AFC01-S18FCA-00/253925.html; Supplier: LCSC; Locking Feature: 翻盖式; Contact Type: 下接; Number of Contacts: 18P; Pitch: 0.5mm; Mounting Type: 卧贴; FFC, FCB Thickness: 0.3mm; Height Above Board: 2mm

## Nets
3V3_GPS: 10uF4.1 C60.2 C103.2 C112.1 R118.2 U19.2(VOUT) U32.8(VCC_MAIN)
3V3_MCU: 10uF2.1 BUZZER1.1(+) C4.2 C55.2 C56.2 C57.2 C58.2 C93.1 C94.2 C97.2 C101.2 C102.2 C110.2 C111.2 FPC2.9 FPC2.10 H2.6 R81.1 R105.2 R112.2 R113.2 R114.1 R123.2 R126.1 U13.2(VCC) U13.4(RST) U15.1 U17.2(VOUT) U27.4(VCC) U28.13(VDDA/VREF+) U28.19(VDD) U28.32(VDD) U28.48(VDD) U28.64(VDD) U30.8(VCC) U33.6(VDDIO) U33.8(VDD) U35.1(VCC) U35.9(VREF) U35.10(IOVDD)
+5V: C5.2 R22.1 U18.5(VCC) USB2.A4B9(VBUS) USB2.B4A9(VBUS)
GND: 10uF1.2 10uF2.2 10uF3.2 10uF4.2 BUZZER1.3(NC) C1.1 C2.1 C4.1 C5.1 C8.1 C9.2 C11.1 C55.1 C56.1 C57.1 C58.1 C59.1 C60.1 C72.1 C93.2 C94.1 C96.1 C97.1 C98.1 C101.1 C102.1 C103.1 C105.1 C107.2 C110.1 C111.1 C112.2 C113.1 C114.1 CARD1.6(VSS) CARD1.10(GND) CARD1.11(GND) CARD1.12(GND) CARD1.13(GND) FPC2.11 FPC2.18 H2.5 Q9.2(S) Q10.2(S) Q11.2(S) R83.2 R91.2 R92.2 R94.1 R95.1 R104.2 R110.2 R122.1 R124.1 R127.1 RF4.2 RF4.3 U9.1(TEMP) U9.3(GND) U9.9(EP) U13.3(GND) U13.5(BRTS) U13.6(CTS) U17.1(GND) U18.3(GND) U19.1(GND) U27.2(GND) U27.5(WP) U28.12(VSSA/VREF-) U28.18(VSS) U28.28(PB2) U28.63(VSS) U30.4(GND) U31.1 U32.1(GND) U32.10(GND) U32.12(GND) U33.1(GND) U33.5(SDO) U33.7(GND) U34.2(S1) U35.6(GND) U35.7(VBAT) U35.8(AUX) U36.A USB2.A1B12(GND) USB2.B1A12(GND)
VBAT_OUT: L10.1 L11.1 U21.3(D)
VCC_RTC: C96.2 C105.2 C114.2 D22.1(K) U28.1(VBAT) U32.6(VCC_BACKUP)
VIN: 10uF1.1 C11.2 L10.2 R96.2 U17.3(VIN)
BAT+: C113.2 D21.2(A) H1.2 R93.1 R125.1 U9.5(BAT) U21.2(S)
BAT-: C109.2 H1.1 U34.3(S2) U34.6(VSS)
BAT_CHG_DET: D20.2(A) U28.47(PH2)
BAT_DET: R95.2 R96.1 U28.14(PA0)
BOOT0: R83.1 U15.2 U28.60(BOOT0)
BT_RX: U13.7(TXD) U28.43(PA10)
BT_TX: U13.8(RXD) U28.42(PA9)
BUZZ: Q10.1(G) R104.1 U28.38(PC7)
CC1: R91.1 USB2.A5(CC1)
CC2: R92.1 USB2.B5(CC2)
D+: U18.1(UD+) USB2.A6(DP1)
D-: U18.2(UD-) USB2.A7(DN1)
EC_A: U28.56(PB4) U36.B
EC_B: U28.57(PB5) U36.D
EC_KEY: D23.1(K) D24.1(K) U36.C
EC_KEY_DET: D24.2(A) U28.50(PA15)
GPS_RX: R115.1 U28.17(PA3)
GPS_TX: R116.1 U28.16(PA2)
MCU_RX: H2.1 U18.6(TXD) U28.61(PB8)
MCU_SCL: R112.1 U27.1(SCL) U28.58(PB6) U33.4(SCK)
MCU_SDA: R113.1 U27.3(SDA) U28.59(PB7) U33.3(SDA)
MCU_TX: H2.2 U18.7(RXD) U28.62(PB9)
OTG_D+: U28.45(PA12) USB2.B6(DP2)
OTG_D-: U28.44(PA11) USB2.B7(DN2)
PWR_EN: D19.2(A) U28.54(PD2)
QSPI_CS: U28.52(PC11) U30.1(CS#)
QSPI_IO0: U28.40(PC9) U30.5(DI(IO0))
QSPI_IO1: U28.51(PC10) U30.2(DO(IO1))
QSPI_IO2: U28.39(PC8) U30.3(WP#(IO2))
QSPI_IO3: U28.55(PB3) U30.7(HOLD#orRESET#(IO3))
QSPI_SCK: U28.27(PB1) U30.6(CLK)
RST: C98.2 R114.2 U28.7(NRST) U31.2
SCR_BLK: Q11.1(G) R110.1 U28.29(PB10)
SCR_CS: FPC2.14 U28.26(PB0)
SCR_DC: FPC2.15 U28.20(PA4)
SCR_RES: FPC2.17 U28.30(PB11)
SCR_SCL: FPC2.16 U28.21(PA5)
SCR_SDA: FPC2.13 U28.23(PA7)
SD_CD: CARD1.9(CD) U28.41(PA8)
SD_CK: CARD1.5(CLK(SCLK)) U28.24(PC4)
SD_CMD: CARD1.3(CMD(DI)) U28.25(PC5)
SD_D0: CARD1.7(DAT0(D0)) U28.8(PC0)
SD_D1: CARD1.8(DAT1(RSV)) U28.9(PC1)
SD_D2: CARD1.1(DAT2(RSV)) U28.10(PC2)
SD_D3: CARD1.2(CDDAT3(CS)) U28.11(PC3)
SWCLK: H2.3 U28.49(PA14)
SWDIO: H2.4 U28.46(PA13)
TP_CS: U28.33(PB12) U35.15(CS#)
TP_IRQ: R126.2 U28.37(PC6) U35.11(PENIRQ#)
TP_SCL: U28.34(PB13) U35.16(DCLK)
TP_SDA: U28.36(PB15) U35.14(DIN)
TP_SDO: U28.35(PB14) U35.12(DOUT)
VIBRATOR: D18.1(K) R120.2 R121.2 U28.15(PA1)
X+: FPC2.2 U35.2(XP)
X-: FPC2.4 U35.4(XN)
Y+: FPC2.1 U35.3(YP)
Y-: FPC2.3 U35.5(YN)
$1N78: C72.2 CARD1.4(VDD) R105.1
$1N6600: R81.2 U14.2(A)
$1N6604: U13.1(LINK) U14.1(K)
$1N8851: BUZZER1.2(-) Q10.3(D)
$1N13627: FPC2.5 FPC2.6 FPC2.7 FPC2.8 R111.2
$1N16083: Q11.3(D) R111.1
$1N23860: R115.2 U32.2(TXD)
$1N23871: R116.2 U32.3(RXD)
$1N24060: LED3.1(K) U32.4(PPS)
$1N24064: LED3.2(A) R118.1
$1N24177: C106.2 U32.11(GNSS_ANT)
$1N24337: C107.1 L16.1 U32.14(VCC_RF)
$1N24429: C106.1 L16.2 RF4.1
$1N24713: D18.2(A) H3.2 R120.1 R122.2 R123.1
$1N24945: H3.1 R121.1
$2N1273: R127.2 U9.2(PROG)
$2N1282: LED2.1(K) U9.6(STDBY#)
$2N1283: D20.1(K) U7.1(K) U9.7(CHRG#)
$2N1284: LED2.2(A) R3.2 U7.2(A)
$2N1287: C1.2 C2.2 C8.2 R3.1 R22.2 U9.4(VCC) U9.8(CE)
$2N3472: C9.1 U18.8(V3)
$2N8043: D23.2(A) Q9.3(D) R93.2 U21.1(G)
$2N8046: D19.1(K) Q9.1(G) R94.2
$2N8413: 10uF3.1 C59.2 L11.2 U19.3(VIN)
$2N15400: C109.1 R125.2 U34.5(VDD)
$2N15404: R124.2 U34.1(V-)
$2N18575: D21.1(K) D22.2(A)

Not connected (* = marked no-connect by the designer): FPC2 12* 19* 20*; U18 4(RTS#)*; U28 2(PC13)* 3(PC14)* 4(PC15)* 5(PH0)* 6(PH1)* 22(PA6)* 31(PH3)* 53(PC12)*; U32 5(WAKE_UP)* 7(RESERVED)* 9(RESET)* 13(ANT_ON)* 15(RESERVED)* 16(RESERVED)* 17(RESERVED)* 18(SET)*; U33 2(CSB)*; U34 4(D)*; U35 13(BUSY)*; U36 0*; USB2 A8(SBU1)* B8(SBU2)* EP*; X1 1 2 3 4 5 6 7 8 9 10 11 12 13 14 15 16 17 18 19 20

## Notes on the sheets
sheet 1
- MCU
- EEPROM
- 气压计
- 电阻触摸
- 编码器
- 屏幕
- 蓝牙
- GPS
- TF卡
- 蜂鸣器
sheet 2
- 充电IC电路
- 充电电流选择Rprog=1100/I
  充电电流：1100/0.5A=2.2K
- 电源输入-
- VIN：4.2~6V
- 电源输入+
- 过充过放保护
- 单节电池接口
- 充电输入接口&USART1
